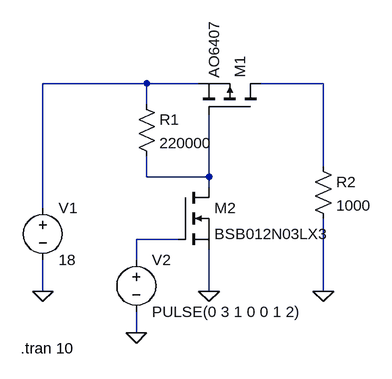
[diagram p0: schematic high_side_switch.asc]
high_side_switch.asc, the LTspice schematic file:
Version 4
SHEET 1 880 680
WIRE 304 -176 144 -176
WIRE 384 -176 304 -176
WIRE 576 -176 480 -176
WIRE 304 -144 304 -176
WIRE 576 -48 576 -176
WIRE 304 -32 304 -64
WIRE 400 -32 400 -128
WIRE 400 -32 304 -32
WIRE 400 -16 400 -32
WIRE 144 16 144 -176
WIRE 352 64 288 64
WIRE 288 96 288 64
WIRE 144 144 144 96
WIRE 400 144 400 80
WIRE 576 144 576 32
WIRE 288 208 288 176
FLAG 144 144 0
FLAG 400 144 0
FLAG 576 144 0
FLAG 288 208 0
SYMBOL voltage 144 0 R0
WINDOW 123 0 0 Left 0
WINDOW 39 0 0 Left 0
SYMATTR InstName V1
SYMATTR Value 18
SYMBOL pmos 480 -128 M270
SYMATTR InstName M1
SYMATTR Value AO6407
SYMBOL res 288 -160 R0
SYMATTR InstName R1
SYMATTR Value 220000
SYMBOL nmos 352 -16 R0
SYMATTR InstName M2
SYMATTR Value BSB012N03LX3
SYMBOL res 560 -64 R0
SYMATTR InstName R2
SYMATTR Value 1000
SYMBOL voltage 288 80 R0
WINDOW 123 0 0 Left 0
WINDOW 39 0 0 Left 0
SYMATTR InstName V2
SYMATTR Value PULSE(0 3 1 0 0 1 2)
TEXT 110 232 Left 2 !.tran 10

The netlist it stands for:
* high_side_switch.asc
V1 N001 0 18
M1 N002 N003 N001 N001 AO6407
R1 N001 N003 220000
M2 N003 N004 0 0 BSB012N03LX3
R2 N002 0 1000
V2 N004 0 PULSE(0 3 1 0 0 1 2)
.model NMOS NMOS
.model PMOS PMOS
.lib standard.mos
.tran 10
.backanno
.end